# Altium project Matrix.PrjPcb
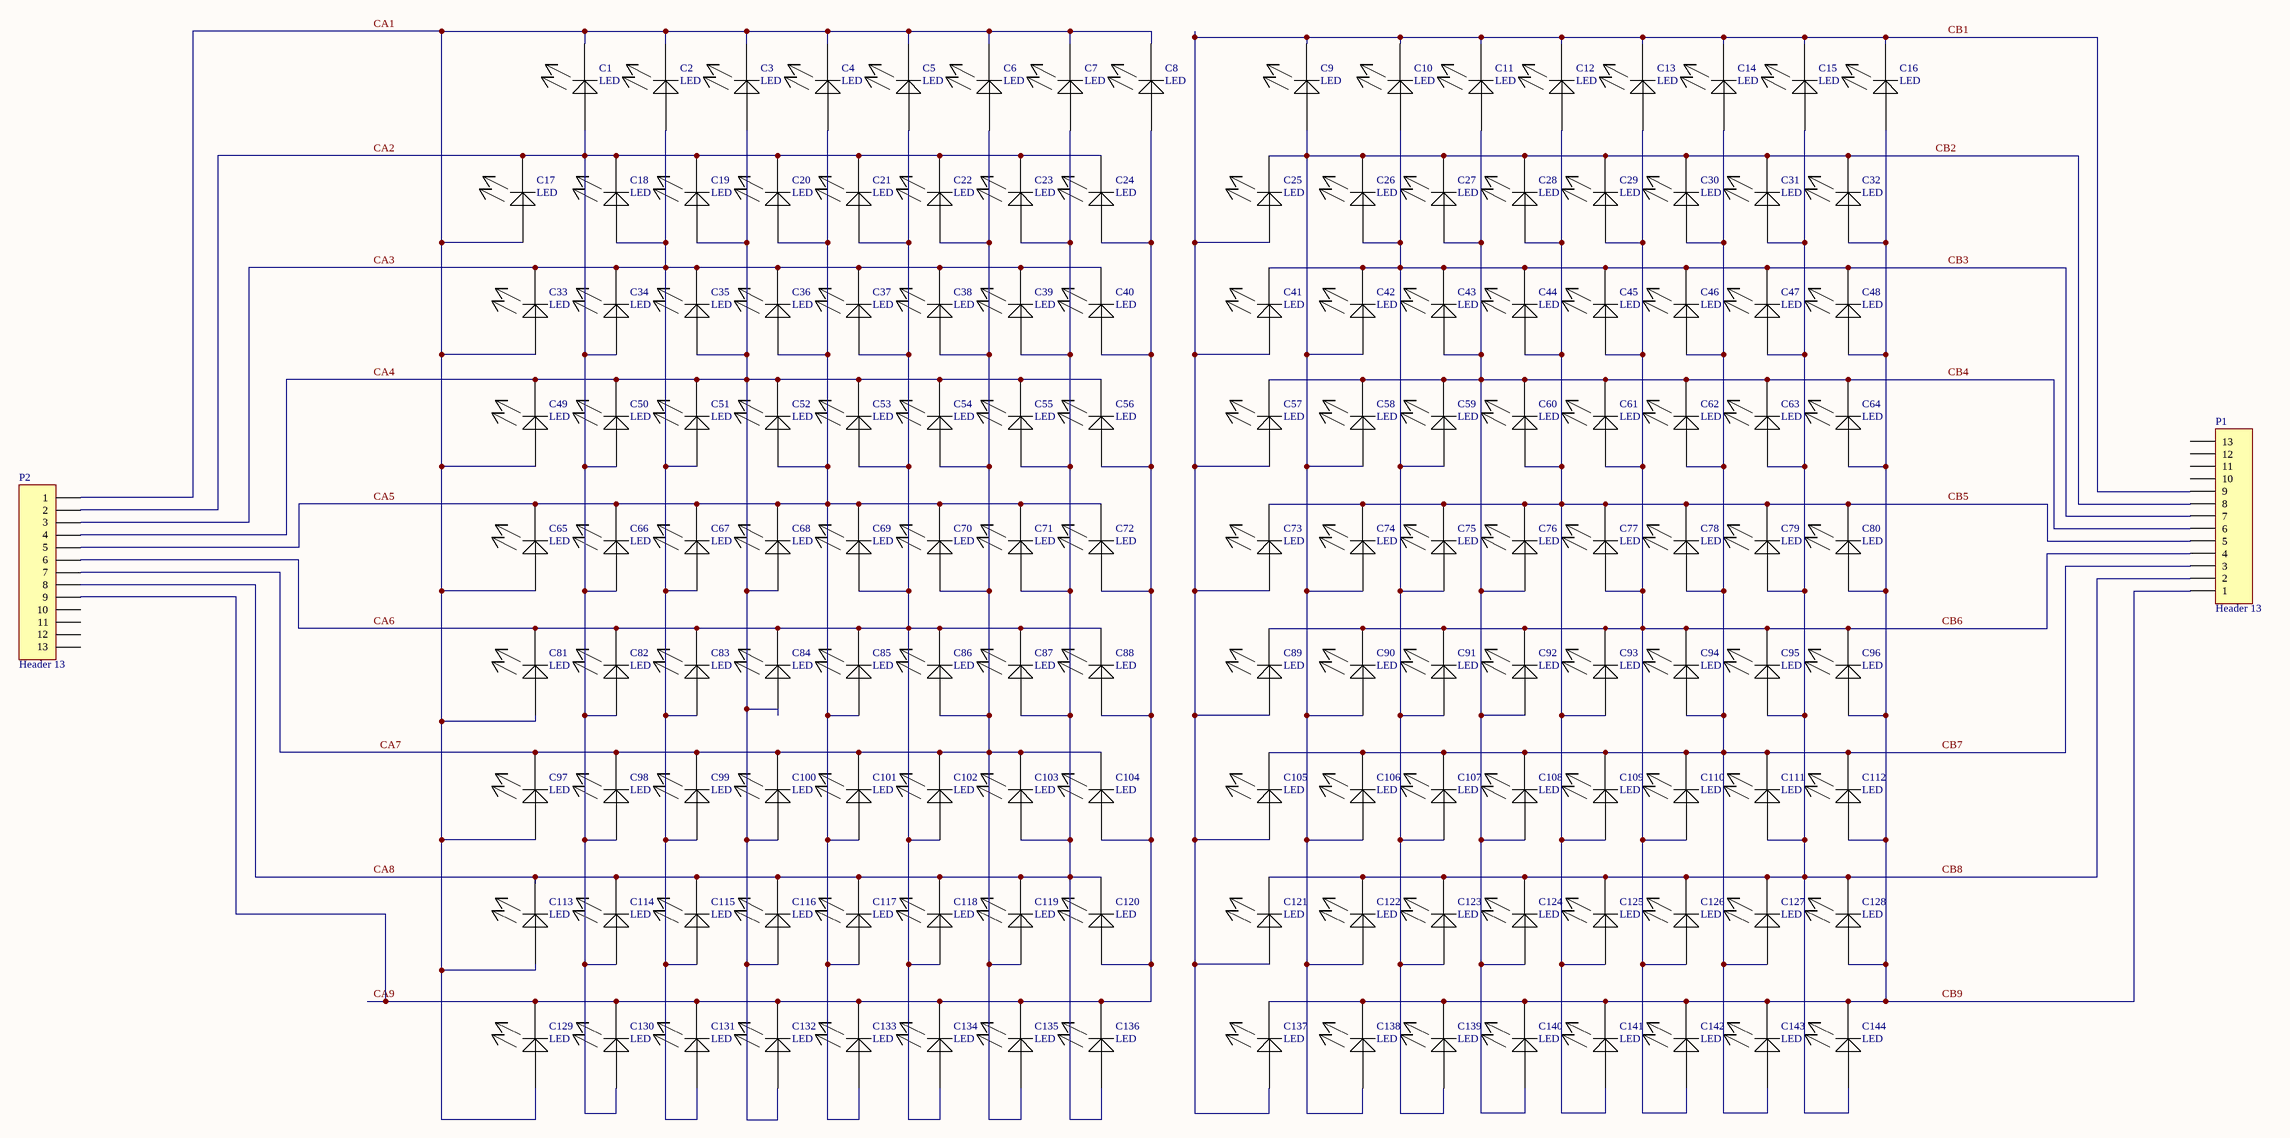
[diagram p0: Sheet1.SchDoc]
1 sheet, 146 parts. Net scope: global (net labels, ports and power ports of the same name join across sheets).
Board file: PCB1.PcbDoc

## Sheet Sheet1.SchDoc
size A1

### Parts
C1  LED  [LED 0603(2)]
C2  LED  [LED 0603(2)]
C3  LED  [LED 0603(2)]
C4  LED  [LED 0603(2)]
C5  LED  [LED 0603(2)]
C6  LED  [LED 0603(2)]
C7  LED  [LED 0603(2)]
C8  LED  [LED 0603(2)]
C9  LED  [LED 0603(2)]
C10  LED  [LED 0603(2)]
C11  LED  [LED 0603(2)]
C12  LED  [LED 0603(2)]
C13  LED  [LED 0603(2)]
C14  LED  [LED 0603(2)]
C15  LED  [LED 0603(2)]
C16  LED  [LED 0603(2)]
C17  LED  [LED 0603(2)]
C18  LED  [LED 0603(2)]
C19  LED  [LED 0603(2)]
C20  LED  [LED 0603(2)]
C21  LED  [LED 0603(2)]
C22  LED  [LED 0603(2)]
C23  LED  [LED 0603(2)]
C24  LED  [LED 0603(2)]
C25  LED  [LED 0603(2)]
C26  LED  [LED 0603(2)]
C27  LED  [LED 0603(2)]
C28  LED  [LED 0603(2)]
C29  LED  [LED 0603(2)]
C30  LED  [LED 0603(2)]
C31  LED  [LED 0603(2)]
C32  LED  [LED 0603(2)]
C33  LED  [LED 0603(2)]
C34  LED  [LED 0603(2)]
C35  LED  [LED 0603(2)]
C36  LED  [LED 0603(2)]
C37  LED  [LED 0603(2)]
C38  LED  [LED 0603(2)]
C39  LED  [LED 0603(2)]
C40  LED  [LED 0603(2)]
C41  LED  [LED 0603(2)]
C42  LED  [LED 0603(2)]
C43  LED  [LED 0603(2)]
C44  LED  [LED 0603(2)]
C45  LED  [LED 0603(2)]
C46  LED  [LED 0603(2)]
C47  LED  [LED 0603(2)]
C48  LED  [LED 0603(2)]
C49  LED  [LED 0603(2)]
C50  LED  [LED 0603(2)]
C51  LED  [LED 0603(2)]
C52  LED  [LED 0603(2)]
C53  LED  [LED 0603(2)]
C54  LED  [LED 0603(2)]
C55  LED  [LED 0603(2)]
C56  LED  [LED 0603(2)]
C57  LED  [LED 0603(2)]
C58  LED  [LED 0603(2)]
C59  LED  [LED 0603(2)]
C60  LED  [LED 0603(2)]
C61  LED  [LED 0603(2)]
C62  LED  [LED 0603(2)]
C63  LED  [LED 0603(2)]
C64  LED  [LED 0603(2)]
C65  LED  [LED 0603(2)]
C66  LED  [LED 0603(2)]
C67  LED  [LED 0603(2)]
C68  LED  [LED 0603(2)]
C69  LED  [LED 0603(2)]
C70  LED  [LED 0603(2)]
C71  LED  [LED 0603(2)]
C72  LED  [LED 0603(2)]
C73  LED  [LED 0603(2)]
C74  LED  [LED 0603(2)]
C75  LED  [LED 0603(2)]
C76  LED  [LED 0603(2)]
C77  LED  [LED 0603(2)]
C78  LED  [LED 0603(2)]
C79  LED  [LED 0603(2)]
C80  LED  [LED 0603(2)]
C81  LED  [LED 0603(2)]
C82  LED  [LED 0603(2)]
C83  LED  [LED 0603(2)]
C84  LED  [LED 0603(2)]
C85  LED  [LED 0603(2)]
C86  LED  [LED 0603(2)]
C87  LED  [LED 0603(2)]
C88  LED  [LED 0603(2)]
C89  LED  [LED 0603(2)]
C90  LED  [LED 0603(2)]
C91  LED  [LED 0603(2)]
C92  LED  [LED 0603(2)]
C93  LED  [LED 0603(2)]
C94  LED  [LED 0603(2)]
C95  LED  [LED 0603(2)]
C96  LED  [LED 0603(2)]
C97  LED  [LED 0603(2)]
C98  LED  [LED 0603(2)]
C99  LED  [LED 0603(2)]
C100  LED  [LED 0603(2)]
C101  LED  [LED 0603(2)]
C102  LED  [LED 0603(2)]
C103  LED  [LED 0603(2)]
C104  LED  [LED 0603(2)]
C105  LED  [LED 0603(2)]
C106  LED  [LED 0603(2)]
C107  LED  [LED 0603(2)]
C108  LED  [LED 0603(2)]
C109  LED  [LED 0603(2)]
C110  LED  [LED 0603(2)]
C111  LED  [LED 0603(2)]
C112  LED  [LED 0603(2)]
C113  LED  [LED 0603(2)]
C114  LED  [LED 0603(2)]
C115  LED  [LED 0603(2)]
C116  LED  [LED 0603(2)]
C117  LED  [LED 0603(2)]
C118  LED  [LED 0603(2)]
C119  LED  [LED 0603(2)]
C120  LED  [LED 0603(2)]
C121  LED  [LED 0603(2)]
C122  LED  [LED 0603(2)]
C123  LED  [LED 0603(2)]
C124  LED  [LED 0603(2)]
C125  LED  [LED 0603(2)]
C126  LED  [LED 0603(2)]
C127  LED  [LED 0603(2)]
C128  LED  [LED 0603(2)]
C129  LED  [LED 0603(2)]
C130  LED  [LED 0603(2)]
C131  LED  [LED 0603(2)]
C132  LED  [LED 0603(2)]
C133  LED  [LED 0603(2)]
C134  LED  [LED 0603(2)]
C135  LED  [LED 0603(2)]
C136  LED  [LED 0603(2)]
C137  LED  [LED 0603(2)]
C138  LED  [LED 0603(2)]
C139  LED  [LED 0603(2)]
C140  LED  [LED 0603(2)]
C141  LED  [LED 0603(2)]
C142  LED  [LED 0603(2)]
C143  LED  [LED 0603(2)]
C144  LED  [LED 0603(2)]
P1  Header 13  [HDR1X13]
P2  Header 13  [HDR1X13]

### Nets
CA1: C1.2(-) C2.2(-) C3.2(-) C4.2(-) C5.2(-) C6.2(-) C7.2(-) C8.2(-) C17.1(+) C33.1(+) C49.1(+) C65.1(+) C81.1(+) C97.1(+) C113.1(+) C129.1(+) P2.1
CA2: C1.1(+) C17.2(-) C18.2(-) C19.2(-) C20.2(-) C21.2(-) C22.2(-) C23.2(-) C24.2(-) C34.1(+) C50.1(+) C66.1(+) C82.1(+) C98.1(+) C114.1(+) C130.1(+) P2.2
CA3: C2.1(+) C18.1(+) C33.2(-) C34.2(-) C35.2(-) C36.2(-) C37.2(-) C38.2(-) C39.2(-) C40.2(-) C51.1(+) C67.1(+) C83.1(+) C99.1(+) C115.1(+) C131.1(+) P2.3
CA4: C3.1(+) C19.1(+) C35.1(+) C49.2(-) C50.2(-) C51.2(-) C52.2(-) C53.2(-) C54.2(-) C55.2(-) C56.2(-) C68.1(+) C84.1(+) C100.1(+) C116.1(+) C132.1(+) P2.4
CA5: C4.1(+) C20.1(+) C36.1(+) C52.1(+) C65.2(-) C66.2(-) C67.2(-) C68.2(-) C69.2(-) C70.2(-) C71.2(-) C72.2(-) C85.1(+) C101.1(+) C117.1(+) C133.1(+) P2.5
CA6: C5.1(+) C21.1(+) C37.1(+) C53.1(+) C69.1(+) C81.2(-) C82.2(-) C83.2(-) C84.2(-) C85.2(-) C86.2(-) C87.2(-) C88.2(-) C102.1(+) C118.1(+) C134.1(+) P2.6
CA7: C6.1(+) C22.1(+) C38.1(+) C54.1(+) C70.1(+) C86.1(+) C97.2(-) C98.2(-) C99.2(-) C100.2(-) C101.2(-) C102.2(-) C103.2(-) C104.2(-) C119.1(+) C135.1(+) P2.7
CA8: C7.1(+) C23.1(+) C39.1(+) C55.1(+) C71.1(+) C87.1(+) C103.1(+) C113.2(-) C114.2(-) C115.2(-) C116.2(-) C117.2(-) C118.2(-) C119.2(-) C120.2(-) C136.1(+) P2.8
CA9: C8.1(+) C24.1(+) C40.1(+) C56.1(+) C72.1(+) C88.1(+) C104.1(+) C120.1(+) C129.2(-) C130.2(-) C131.2(-) C132.2(-) C133.2(-) C134.2(-) C135.2(-) C136.2(-) P2.9
CB1: C9.2(-) C10.2(-) C11.2(-) C12.2(-) C13.2(-) C14.2(-) C15.2(-) C16.2(-) C25.1(+) C41.1(+) C57.1(+) C73.1(+) C89.1(+) C105.1(+) C121.1(+) C137.1(+) P1.9
CB2: C9.1(+) C25.2(-) C26.2(-) C27.2(-) C28.2(-) C29.2(-) C30.2(-) C31.2(-) C32.2(-) C42.1(+) C58.1(+) C74.1(+) C90.1(+) C106.1(+) C122.1(+) C138.1(+) P1.8
CB3: C10.1(+) C26.1(+) C41.2(-) C42.2(-) C43.2(-) C44.2(-) C45.2(-) C46.2(-) C47.2(-) C48.2(-) C59.1(+) C75.1(+) C91.1(+) C107.1(+) C123.1(+) C139.1(+) P1.7
CB4: C11.1(+) C27.1(+) C43.1(+) C57.2(-) C58.2(-) C59.2(-) C60.2(-) C61.2(-) C62.2(-) C63.2(-) C64.2(-) C76.1(+) C92.1(+) C108.1(+) C124.1(+) C140.1(+) P1.6
CB5: C12.1(+) C28.1(+) C44.1(+) C60.1(+) C73.2(-) C74.2(-) C75.2(-) C76.2(-) C77.2(-) C78.2(-) C79.2(-) C80.2(-) C93.1(+) C109.1(+) C125.1(+) C141.1(+) P1.5
CB6: C13.1(+) C29.1(+) C45.1(+) C61.1(+) C77.1(+) C89.2(-) C90.2(-) C91.2(-) C92.2(-) C93.2(-) C94.2(-) C95.2(-) C96.2(-) C110.1(+) C126.1(+) C142.1(+) P1.4
CB7: C14.1(+) C30.1(+) C46.1(+) C62.1(+) C78.1(+) C94.1(+) C105.2(-) C106.2(-) C107.2(-) C108.2(-) C109.2(-) C110.2(-) C111.2(-) C112.2(-) C127.1(+) C143.1(+) P1.3
CB8: C15.1(+) C31.1(+) C47.1(+) C63.1(+) C79.1(+) C95.1(+) C111.1(+) C121.2(-) C122.2(-) C123.2(-) C124.2(-) C125.2(-) C126.2(-) C127.2(-) C128.2(-) C144.1(+) P1.2
CB9: C16.1(+) C32.1(+) C48.1(+) C64.1(+) C80.1(+) C96.1(+) C112.1(+) C128.1(+) C137.2(-) C138.2(-) C139.2(-) C140.2(-) C141.2(-) C142.2(-) C143.2(-) C144.2(-) P1.1

Not connected (* = marked no-connect by the designer): P1 10 11 12 13; P2 10 11 12 13

### Library data of the parts
P1 P2 = Header 13: Header, 13-Pin; LatestRevisionDate: 17-Jul-2002; LatestRevisionNote: Re-released for DXP Platform.; Publisher: Altium Limited